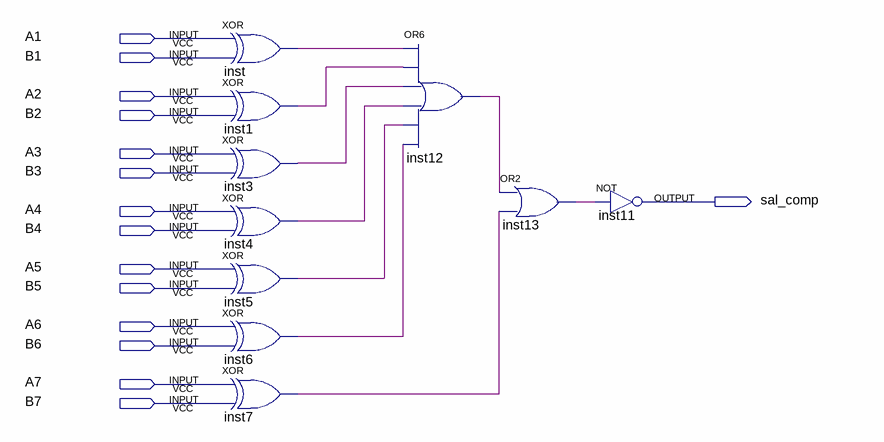
[diagram p0: schematic sheet]
// Quartus schematic comparador_7b.bdf as structural Verilog: 10 symbols, 15 pins
module comparador_7b (
  input  A1,
  input  B1,
  input  A2,
  input  B2,
  input  A3,
  input  B3,
  input  A4,
  input  B4,
  input  A5,
  input  B5,
  input  A6,
  input  B6,
  input  A7,
  input  B7,
  output sal_comp
);

  wire inst1_out, inst3_out, inst4_out, inst5_out, inst6_out, inst7_out, inst12_out, inst13_out, inst_out;

  xor inst (inst_out, A1, B1);
  xor inst1 (inst1_out, A2, B2);
  xor inst3 (inst3_out, A3, B3);
  xor inst4 (inst4_out, A4, B4);
  xor inst5 (inst5_out, A5, B5);
  xor inst6 (inst6_out, A6, B6);
  xor inst7 (inst7_out, A7, B7);
  or inst12 (inst12_out, inst_out, inst1_out, inst3_out, inst4_out, inst5_out, inst6_out);
  or inst13 (inst13_out, inst12_out, inst7_out);
  not inst11 (sal_comp, inst13_out);
endmodule
